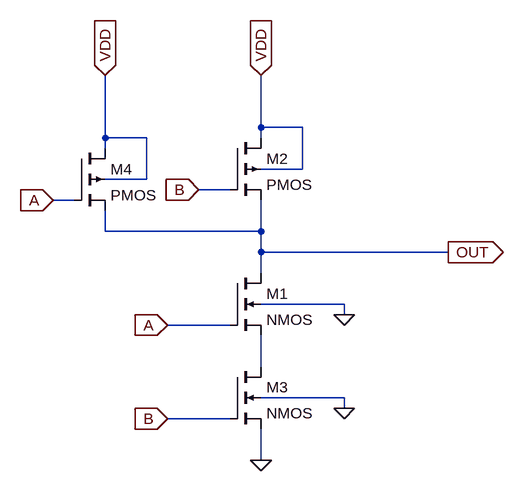
[diagram p0: schematic nand.asc]
nand.asc, the LTspice schematic file:
Version 4
SHEET 1 880 680
WIRE 272 -32 272 -112
WIRE 336 -32 272 -32
WIRE 32 -16 32 -112
WIRE 96 -16 32 -16
WIRE 272 -16 272 -32
WIRE 32 0 32 -16
WIRE 336 32 336 -32
WIRE 336 32 272 32
WIRE 96 48 96 -16
WIRE 96 48 32 48
WIRE 224 64 176 64
WIRE -16 80 -48 80
WIRE 32 128 32 96
WIRE 272 128 272 80
WIRE 272 128 32 128
WIRE 272 160 272 128
WIRE 560 160 272 160
WIRE 272 192 272 160
WIRE 400 240 272 240
WIRE 400 256 400 240
WIRE 224 272 128 272
WIRE 272 336 272 288
WIRE 400 384 272 384
WIRE 400 400 400 384
WIRE 224 416 128 416
WIRE 272 480 272 432
FLAG 400 256 0
FLAG 400 400 0
FLAG 272 480 0
FLAG 32 -112 VDD
IOPIN 32 -112 In
FLAG 272 -112 VDD
IOPIN 272 -112 In
FLAG 128 272 A
IOPIN 128 272 In
FLAG -48 80 A
IOPIN -48 80 In
FLAG 176 64 B
IOPIN 176 64 In
FLAG 128 416 B
IOPIN 128 416 In
FLAG 560 160 OUT
IOPIN 560 160 Out
SYMBOL nmos4 224 192 R0
SYMATTR InstName M1
SYMATTR Value2 l=200n w=1u
SYMBOL pmos4 224 -16 R0
SYMATTR InstName M2
SYMATTR Value2 l=200n w=1.5u
SYMBOL nmos4 224 336 R0
SYMATTR InstName M3
SYMATTR Value2 l=200n w=1u
SYMBOL pmos4 -16 0 R0
SYMATTR InstName M4
SYMATTR Value2 l=200n w=1.5u

The netlist it stands for:
* nand.asc
M1 OUT A N001 0 NMOS l=200n w=1u
M2 VDD B OUT VDD PMOS l=200n w=1.5u
M3 N001 B 0 0 NMOS l=200n w=1u
M4 VDD A OUT VDD PMOS l=200n w=1.5u
.model NMOS NMOS
.model PMOS PMOS
.lib standard.mos
.backanno
.end